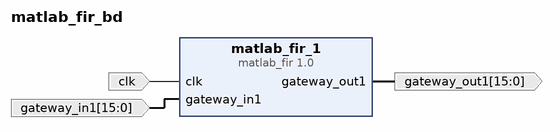
[diagram p0: block diagram of the top level]
# Vivado block design matlab_fir_bd, xc7z020clg484-1, Vivado 2020.1
create_bd_design matlab_fir_bd

create_bd_port -dir I -type clk clk
create_bd_port -dir I -from 15 -to 0 -type data gateway_in1
create_bd_port -dir O -from 15 -to 0 -type data gateway_out1

create_bd_cell -type ip -vlnv User_Company:SysGen:matlab_fir:1.0 matlab_fir_1

# ---- connections ----

connect_bd_net [get_bd_ports clk] [get_bd_pins matlab_fir_1/clk]
connect_bd_net -net gateway_in1_1 [get_bd_ports gateway_in1] [get_bd_pins matlab_fir_1/gateway_in1]
connect_bd_net [get_bd_pins matlab_fir_1/gateway_out1] [get_bd_ports gateway_out1]

validate_bd_design
save_bd_design
